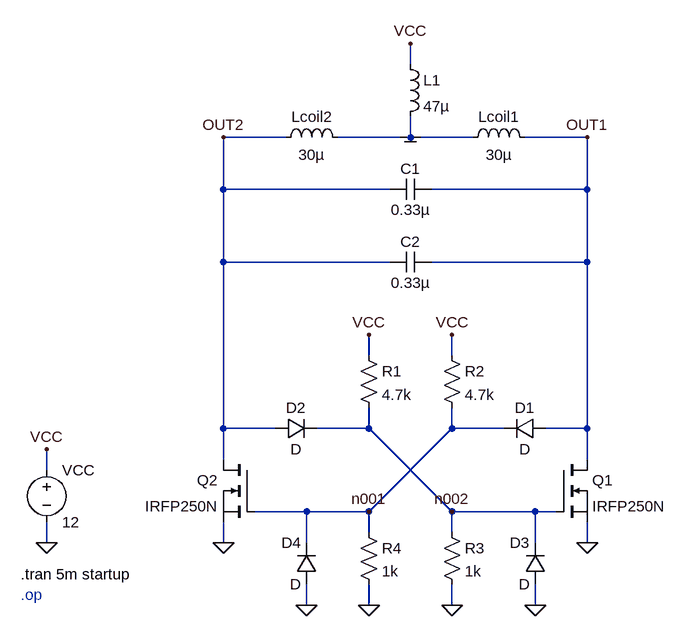
[diagram p0: schematic firefly_lantern.asc]
firefly_lantern.asc, the LTspice schematic file:
Version 4.1
SHEET 1 2752 680
WIRE 2352 -752 2352 -784
WIRE 2160 -640 2064 -640
WIRE 2352 -640 2352 -672
WIRE 2352 -640 2240 -640
WIRE 2448 -640 2352 -640
WIRE 2624 -640 2528 -640
WIRE 2064 -560 2064 -640
WIRE 2320 -560 2064 -560
WIRE 2624 -560 2624 -640
WIRE 2624 -560 2384 -560
WIRE 2064 -448 2064 -560
WIRE 2320 -448 2064 -448
WIRE 2624 -448 2624 -560
WIRE 2624 -448 2384 -448
WIRE 2288 -304 2288 -336
WIRE 2416 -304 2416 -336
WIRE 2064 -192 2064 -448
WIRE 2144 -192 2064 -192
WIRE 2288 -192 2288 -224
WIRE 2288 -192 2208 -192
WIRE 2416 -192 2416 -224
WIRE 2496 -192 2416 -192
WIRE 2624 -192 2624 -448
WIRE 2624 -192 2560 -192
WIRE 2064 -144 2064 -192
WIRE 2624 -144 2624 -192
WIRE 1792 -128 1792 -160
WIRE 2192 -64 2112 -64
WIRE 2288 -64 2416 -192
WIRE 2288 -64 2192 -64
WIRE 2416 -64 2288 -192
WIRE 2544 -64 2416 -64
WIRE 2576 -64 2544 -64
WIRE 2288 -32 2288 -64
WIRE 2416 -32 2416 -64
WIRE 1792 -16 1792 -48
WIRE 2064 -16 2064 -48
WIRE 2192 -16 2192 -64
WIRE 2544 -16 2544 -64
WIRE 2624 -16 2624 -48
WIRE 2192 80 2192 48
WIRE 2288 80 2288 48
WIRE 2416 80 2416 48
WIRE 2544 80 2544 48
FLAG 1792 -16 0
FLAG 1792 -160 VCC
FLAG 2288 -336 VCC
FLAG 2416 -336 VCC
FLAG 2288 80 0
FLAG 2416 80 0
FLAG 2192 80 0
FLAG 2544 80 0
FLAG 2064 -16 0
FLAG 2624 -16 0
FLAG 2352 -784 VCC
FLAG 2624 -640 OUT1
FLAG 2064 -640 OUT2
FLAG 2352 -640 COM
FLAG 2288 -64 n001
FLAG 2416 -64 n002
SYMBOL voltage 1792 -144 R0
WINDOW 123 0 0 Left 0
WINDOW 39 0 0 Left 0
SYMATTR InstName VCC
SYMATTR Value 12
SYMBOL nmos 2576 -144 R0
SYMATTR InstName Q1
SYMATTR Value IRFP250N
SYMBOL nmos 2112 -144 M0
SYMATTR InstName Q2
SYMATTR Value IRFP250N
SYMBOL res 2400 -320 R0
SYMATTR InstName R2
SYMATTR Value 4.7k
SYMBOL res 2272 -320 R0
SYMATTR InstName R1
SYMATTR Value 4.7k
SYMBOL cap 2384 -576 R90
WINDOW 0 0 32 VBottom 2
WINDOW 3 32 32 VTop 2
SYMATTR InstName C1
SYMATTR Value 0.33µ
SYMBOL cap 2384 -464 R90
WINDOW 0 0 32 VBottom 2
WINDOW 3 32 32 VTop 2
SYMATTR InstName C2
SYMATTR Value 0.33µ
SYMBOL diode 2560 -208 R90
WINDOW 0 0 32 VBottom 2
WINDOW 3 32 32 VTop 2
SYMATTR InstName D1
SYMBOL diode 2144 -176 R270
WINDOW 0 32 32 VTop 2
WINDOW 3 0 32 VBottom 2
SYMATTR InstName D2
SYMBOL ind 2432 -624 R270
WINDOW 0 32 56 VTop 2
WINDOW 3 5 56 VBottom 2
SYMATTR InstName Lcoil1
SYMATTR Value 30µ
SYMBOL ind 2144 -624 R270
WINDOW 0 32 56 VTop 2
WINDOW 3 5 56 VBottom 2
SYMATTR InstName Lcoil2
SYMATTR Value 30µ
SYMBOL ind 2336 -768 R0
SYMATTR InstName L1
SYMATTR Value 47µ
SYMBOL diode 2208 48 R180
WINDOW 0 24 64 Left 2
WINDOW 3 24 0 Left 2
SYMATTR InstName D4
SYMBOL res 2272 -48 R0
SYMATTR InstName R4
SYMATTR Value 1k
SYMBOL res 2400 -48 R0
SYMATTR InstName R3
SYMATTR Value 1k
SYMBOL diode 2560 48 R180
WINDOW 0 24 64 Left 2
WINDOW 3 24 0 Left 2
SYMATTR InstName D3
TEXT 1752 32 Left 2 !.tran 5m startup
TEXT 1752 64 Left 2 ;.op

The netlist it stands for:
* firefly_lantern.asc
VCC VCC 0 12
M§Q1 OUT1 n002 0 0 IRFP250N
M§Q2 OUT2 n001 0 0 IRFP250N
R2 VCC n001 4.7k
R1 VCC n002 4.7k
C1 OUT1 OUT2 0.33µ
C2 OUT1 OUT2 0.33µ
D1 OUT1 n001 D
D2 OUT2 n002 D
Lcoil1 COM OUT1 30µ
Lcoil2 OUT2 COM 30µ
L1 VCC COM 47µ
D4 0 n001 D
R4 n001 0 1k
R3 n002 0 1k
D3 0 n002 D
.model D D
.lib standard.dio
.model NMOS NMOS
.model PMOS PMOS
.lib standard.mos
.tran 5m startup
* .op
.backanno
.end